# EAGLE design board1 (EAGLE 7.0.0)
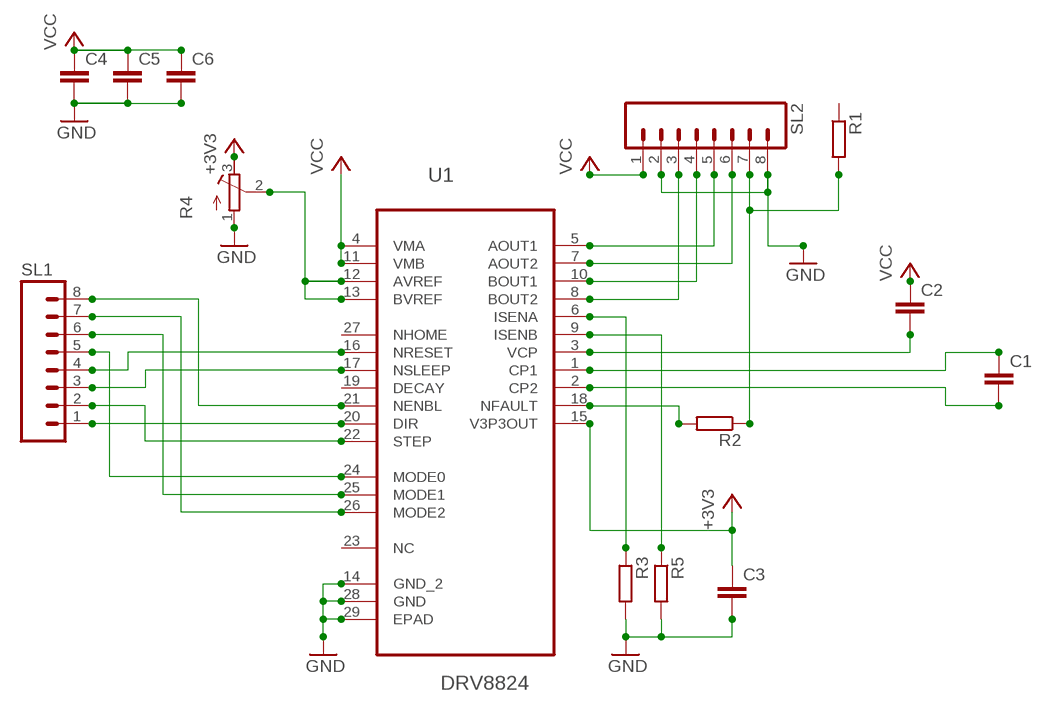
[diagram p0: schematic, sheet 1]

## Parts
C1  C-EU025-030X050  [C025-030X050]
C2  C-EU025-030X050  [C025-030X050]
C3  C-EU025-030X050  [C025-030X050]
C4  C-EU025-030X050  [C025-030X050]
C5  C-EU025-030X050  [C025-030X050]
C6  C-EU025-030X050  [C025-030X050]
R1  R-EU_0207/7  [0207/7]
R2  R-EU_0207/7  [0207/7]
R3  R-EU_0207/7  [0207/7]
R4  R-TRIMM64Y  [RTRIM64Y]
R5  R-EU_0207/7  [0207/7]
SL1  M08  [08P]
SL2  M08  [08P]
U1  DRV8824  DRV8824PWPR  [SOP65P640X120-29N]

## Nets
+3V3: C3.1 R4.3(A) U1.15(V3P3OUT)
AOUT1 [POWER]: SL2.5 U1.5(AOUT1)
AOUT2 [POWER]: SL2.6 U1.7(AOUT2)
BOUT1 [POWER]: SL2.4 U1.10(BOUT1)
BOUT2 [POWER]: SL2.3 U1.8(BOUT2)
GND [POWER]: C3.2 C4.2 C5.2 C6.2 R3.2 R4.1(E) R5.2 SL2.2 SL2.8 U1.14(GND_2) U1.28(GND) U1.29(EPAD)
N$1: SL1.1 U1.20(DIR)
N$2: SL1.2 U1.22(STEP)
N$3: SL1.3 U1.17(NSLEEP)
N$4: SL1.4 U1.16(NRESET)
N$5: SL1.5 U1.24(MODE0)
N$6: SL1.6 U1.25(MODE1)
N$7: SL1.7 U1.26(MODE2)
N$8: SL1.8 U1.21(NENBL)
N$9: R4.2(S) U1.12(AVREF) U1.13(BVREF)
N$10: C1.1 U1.1(CP1)
N$11: C1.2 U1.2(CP2)
N$12: C2.2 U1.3(VCP)
N$17: R2.2 U1.18(NFAULT)
N$18: R1.2 R2.1 SL2.7
N$19: R3.1 U1.6(ISENA)
N$20: R5.1 U1.9(ISENB)
VCC [POWER]: C2.1 C4.1 C5.1 C6.1 SL2.1 U1.4(VMA) U1.11(VMB)
Unconnected: R1.1 U1.19(DECAY) U1.23(NC) U1.27(NHOME)

## Library data of the parts
C1-C6 = resistor:C-EU: CAPACITOR, European symbol
R1-R3 R5 = resistor:R-EU_: RESISTOR, European symbol
R4 = resistor:R-TRIMM: Trimm resistor
SL1 SL2 = con-amp-quick:M08: AMP QUICK CONNECTOR; OC_FARNELL: unknown; OC_NEWARK: unknown
U1 = ti_e14:DRV8824PWPR: STEPPER MOTOR CONTROLLER IC; MPN: DRV8824PWPR; OC_FARNELL: -; OC_NEWARK: 74R6336; PACKAGE: TSSOP-28; SUPPLIER: Texas Instruments

## Board
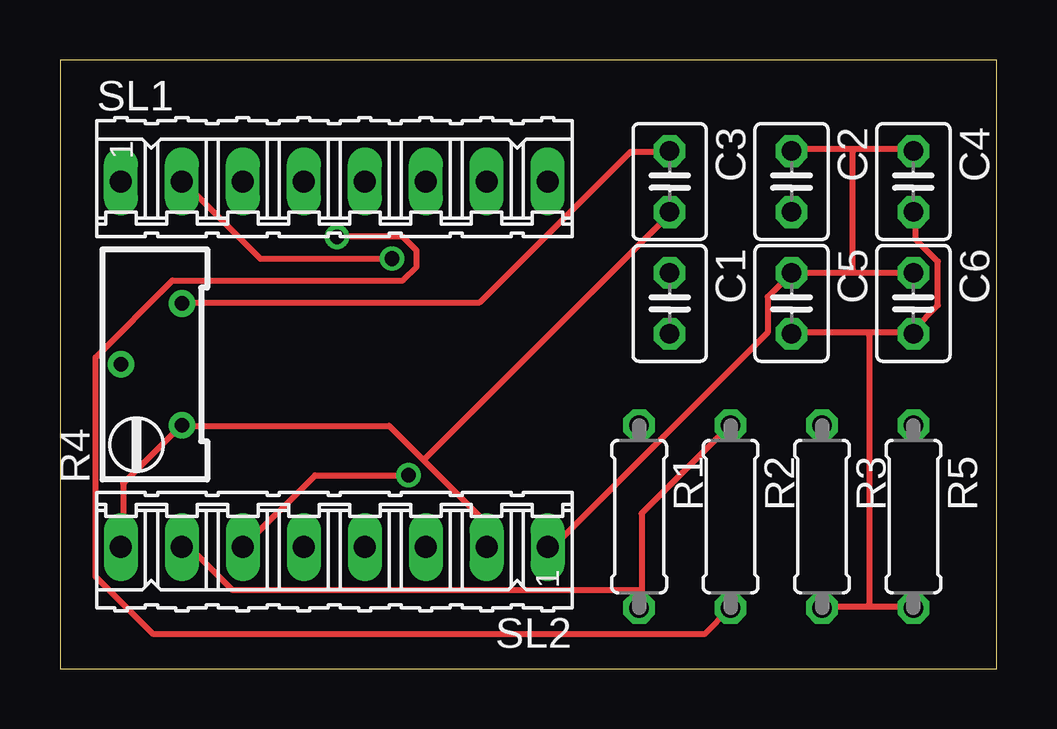
[diagram p1: board, top side]
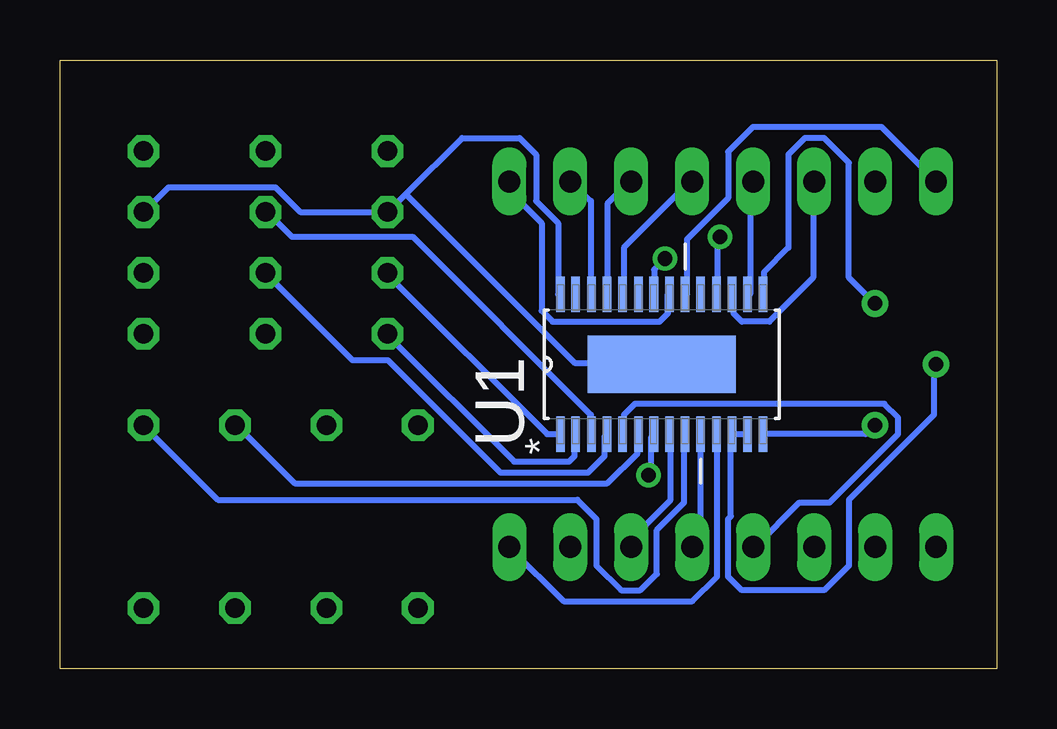
[diagram p2: board, bottom side, seen from below]

Size 39.04 x 25.39 mm. Coordinates in mm from the lower left corner, seen from the top.
Outline: 0,0 39.04,0 39.04,25.39 0,25.39 0,0
Copper layers (1*16): Top 0.035mm / dielectric 1.5mm / Bottom 0.035mm
Design rules "default": minimum track width 10mil, minimum drill 24mil, track to track 8mil, track to pad 8mil, pad to pad 8mil, via to via 8mil, smd to smd 8mil, copper to edge 40mil, drill to drill 8mil, minimum pad ring 10mil, minimum via ring 8mil, stop-mask expansion 4mil, vias tented up to drill 0mil, thermal gap 10mil

### Footprints (pad centres in the part's own frame; a part is rotated, then mirrored left to right if it is on the bottom)
C025-030X050 = drill 0.813 octagon: 1 -1.27,0; 2 1.27,0
0207/7 = drill 0.813 octagon: 1 -3.81,0; 2 3.81,0
RTRIM64Y = drill 0.61: 1 0,-2.54; 2 -2.54,0; 3 0,2.54
08P = drill 0.914 long: 1 -8.89,0; 2 -6.35,0; 3 -3.81,0; 4 -1.27,0; 5 1.27,0; 6 3.81,0; 7 6.35,0; 8 8.89,0
SOP65P640X120-29N = smd 1.473 x 0.356: 1 -2.921,4.216; 2 -2.921,3.581; 3 -2.921,2.921; 4 -2.921,2.286; 5 -2.921,1.626; 6 -2.921,0.965; 7 -2.921,0.33; 8 -2.921,-0.33; 9 -2.921,-0.965; 10 -2.921,-1.626; 11 -2.921,-2.286; 12 -2.921,-2.921; 13 -2.921,-3.581; 14 -2.921,-4.216; 15 2.921,-4.216; 16 2.921,-3.581; 17 2.921,-2.921; 18 2.921,-2.286; 19 2.921,-1.626; 20 2.921,-0.965; 21 2.921,-0.33; 22 2.921,0.33; 23 2.921,0.965; 24 2.921,1.626; 25 2.921,2.286; 26 2.921,2.921; 27 2.921,3.581; 28 2.921,4.216 | smd 2.388 x 6.172: 29 0,0

### Placement (x,y rotation side)
C1  25.4,15.24 270 top
C2  30.48,20.32 270 top
C3  25.4,20.32 270 top
C4  35.56,20.32 270 top
C5  30.48,15.24 270 top
C6  35.56,15.24 270 top
R1  24.13,6.35 270 top
R2  27.94,6.35 270 top
R3  31.75,6.35 270 top
R4  5.08,12.7 0 top
R5  35.56,6.35 270 top
SL1  11.43,20.32 0 top
SL2  11.43,5.08 180 top
U1  13.97,12.7 90 bottom

### Tracks (layer width: path | path; a pad name or v marks a point on that pad's centre or on a via)
+3V3
  Top 0.254: C3.1 25.38,21.57 23.77,21.57 17.49,15.28 5.14,15.28 R4.3
  Bottom 0.254: U1.15 9.72,15.62 9.72,16.54 8.69,17.56 8.69,21.45 8,22.14 7.2,22.14 6.17,21.11 6.17,16.31 5.14,15.28 R4.3
AOUT1
  Bottom 0.254: U1.5 15.54,9.79 15.54,10.59 15.09,11.05 4.69,11.05 4.12,10.48 4.12,9.79 6.97,6.93 8.23,6.93 10.06,5.1 SL2.5
AOUT2  (via drill 0.61)
  Top 0.254: v14.52,8.08 10.63,8.08 7.66,5.1 SL2.6
  Bottom 0.254: v14.52,8.08 14.4,8.19 14.4,9.68 U1.7
BOUT1
  Bottom 0.254: U1.10 12.34,9.68 12.34,5.45 12.69,5.1 SL2.4
BOUT2
  Bottom 0.254: U1.8 13.6,9.68 13.6,7.05 15.2,5.45 15.2,5.1 SL2.3
GND
  Top 0.254: SL2.8 2.63,5.1 2.63,7.73 5.03,10.13 R4.1 5.14,10.13 13.72,10.13 15.14,8.71 | 15.14,8.71 17.72,6.13 17.72,5.1 SL2.2 | 33.72,2.59 35.55,2.59 R5.2 | 33.72,2.59 31.77,2.59 R3.2 | 33.72,14.02 35.55,14.02 C6.2 35.55,14.13 36.58,15.16 36.58,16.99 35.66,17.91 35.66,19.05 C4.2 | 33.72,14.02 30.52,14.02 C5.2 | 33.72,2.59 33.72,2.7 33.72,13.91 33.72,14.02 | 15.14,8.71 15.2,8.76 25.49,19.05 C3.2
  Bottom 0.254: U1.14 9.72,9.79 5.49,9.79 5.14,10.13 R4.1 | 24.63,19.79 25.38,19.05 C3.2 25.49,19.05 29.03,19.05 30.06,20.08 34.52,20.08 35.55,19.05 C4.2 | 24.63,19.79 22.29,22.14 19.89,22.14 19.2,21.45 19.2,19.51 18.29,18.59 18.29,15.62 U1.28 | U1.29 14.06,12.76 17.6,12.76 24.57,19.74 24.63,19.79
N$1
  Bottom 0.254: U1.20 12.92,15.62 12.92,17.91 11.2,19.62 11.2,21.57 10.17,22.59 4.8,22.59 2.63,20.42 SL1.1
N$2  (via drill 0.61)
  Top 0.254: v13.83,17.11 8.34,17.11 5.14,20.31 SL1.2
  Bottom 0.254: v13.83,17.11 14.29,16.65 14.29,15.62 U1.22
N$3
  Bottom 0.254: U1.17 10.97,15.62 10.97,14.82 10.63,14.48 9.49,14.48 7.66,16.31 7.66,20.31 SL1.3
N$4
  Bottom 0.254: U1.16 10.29,15.62 10.29,20.19 10.17,20.31 SL1.4
N$5
  Bottom 0.254: U1.24 15.54,15.62 15.54,17.56 12.8,20.31 SL1.5
N$6
  Bottom 0.254: U1.25 16.23,15.62 16.23,19.39 15.32,20.31 SL1.6
N$7
  Bottom 0.254: U1.26 16.92,15.62 16.92,19.51 17.72,20.31 SL1.7
N$8
  Bottom 0.254: U1.21 13.72,15.62 13.72,14.82 14.06,14.48 18.52,14.48 18.97,14.94 18.97,18.59 20.23,19.85 20.23,20.31 SL1.8
N$9
  Bottom 0.254: U1.13 10.4,9.79 10.97,9.79 U1.12 11.09,9.68 11.09,6.36 11.2,6.25 11.2,3.85 10.63,3.28 7.2,3.28 6.17,4.3 6.17,7.05 2.63,10.59 2.63,12.65 R4.2
N$10
  Bottom 0.254: U1.1 18.29,9.79 18.75,9.79 25.38,16.42 C1.1
N$11
  Bottom 0.254: U1.2 17.6,9.68 17.6,8.88 17.83,8.65 20.12,8.65 25.38,13.91 C1.2
N$12
  Bottom 0.254: U1.3 16.92,9.79 16.92,10.59 24.35,18.02 29.38,18.02 30.4,19.05 C2.2
N$17  (via drill 0.61)
  Top 0.254: v11.54,18.02 14.29,18.02 14.86,17.45 14.86,16.76 14.29,16.19 4.69,16.19 1.49,12.99 1.49,3.85 3.89,1.45 26.86,1.45 27.89,2.48 R2.2
  Bottom 0.254: v11.54,18.02 11.66,17.91 11.66,15.62 U1.18
N$18
  Top 0.254: 24.23,3.28 24.23,6.48 27.89,10.13 R2.1 | 24.23,3.28 24.23,2.59 R1.2 | SL2.7 5.14,4.99 5.49,4.99 7.2,3.28 24.12,3.28 24.23,3.28
N$19
  Bottom 0.254: U1.6 14.97,9.68 14.97,8.99 16.23,7.73 29.26,7.73 31.66,10.13 R3.1
N$20
  Bottom 0.254: U1.9 13.03,9.68 13.03,6.93 14.17,5.79 14.17,3.96 14.86,3.28 15.66,3.28 16.69,4.3 16.69,6.25 17.49,7.05 32.46,7.05 35.55,10.13 R5.1
VCC
  Top 0.254: 33.03,21.68 35.55,21.68 C4.1 | 33.03,21.68 30.52,21.68 C2.1 | 33.03,16.54 30.52,16.54 C5.1 30.4,16.42 29.49,15.51 29.49,14.02 20.57,5.1 20.34,5.1 SL2.1 | 33.03,16.54 35.55,16.54 C6.1 | 33.03,21.68 33.03,21.57 33.03,16.65 33.03,16.54
  Bottom 0.254: U1.11 11.66,9.68 11.66,3.85 12.69,2.82 18.06,2.82 20.23,4.99 SL2.1 | U1.4 16.34,9.68 16.34,8.88 17.03,8.19 20.69,8.19 25.38,12.88 26.86,12.88 30.4,16.42 C5.1